# Altium schematic sheet GolgiBotV2.02_Esp.SchDoc
size A4; SheetNumber: 1; SheetTotal: 1
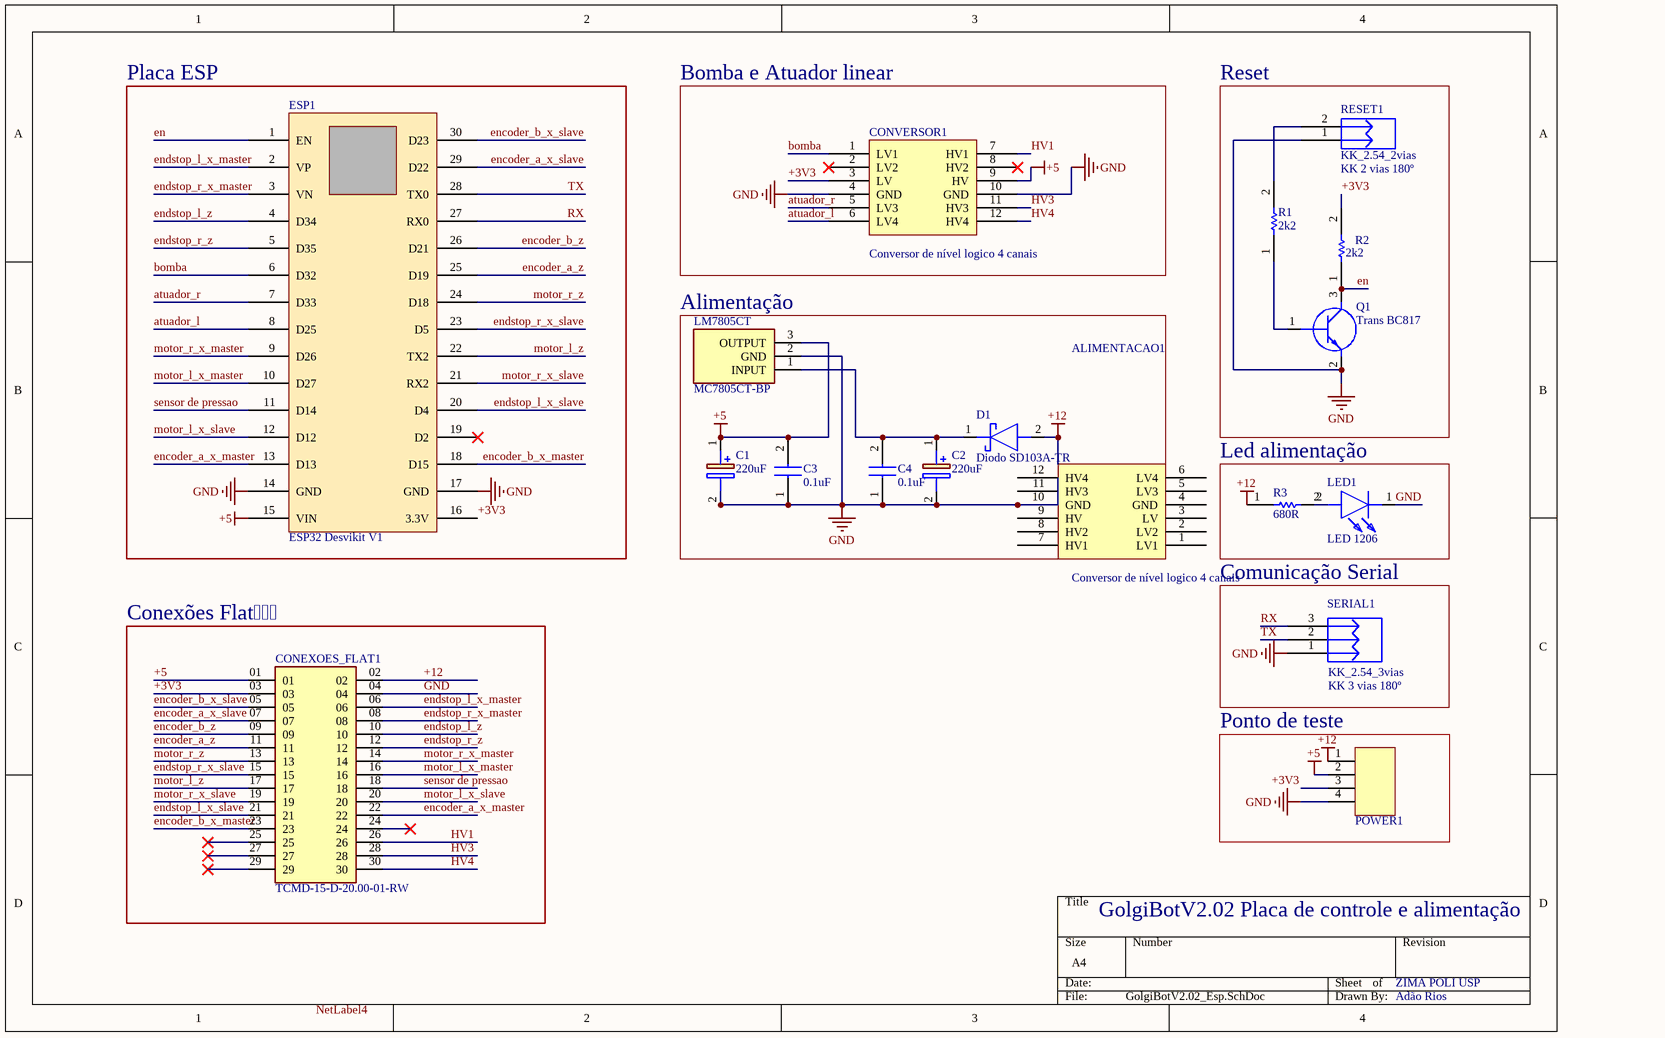
[diagram p0: GolgiBotV2.02_Esp.SchDoc]

## Parts
ALIMENTACAO1  Conversor de nível logico 4 canais  [Conversor de nível lógico 4 canais]
C1  220uF  [CAPPRD200W55D500H1200]
C2  220uF  [CAPPRD200W55D500H1200]
C3  0.1uF  [CAPC3216X180N]
C4  0.1uF  [CAPC3216X180N]
CONEXOES_FLAT1  TCMD-15-D-20.00-01-RW  [SAMTEC_TCMD-15-D-20.00-01-RW]
CONVERSOR1  Conversor de nível logico 4 canais  [Conversor de nível lógico 4 canais]
D1  Diodo SD103A-TR  [DIOAD950W60L350D150]
ESP1  value ESP32 Desvikit V1  [ESP32_Desvikit_v1]  (hidden comment: microcontrolador)
LED1  LED 1206  [LEDC3214X78N]
LM7805CT  MC7805CT-BP  [TO255P460X1020X2008-3P]
POWER1  Testing PADS 1x4  [Testing PADS 1x4]  (value not drawn)
Q1  Trans BC817  [SOT96P240X110-3N]
R1  2k2  [RESC3216X60N]
R2  2k2  [RESC3216X60N]
R3  680R  [RESC3216X60N]
RESET1  KK_2.54_2vias  Valor: KK 2 vias 180º  [KK_2VIAS_180º]
SERIAL1  KK_2.54_3vias  Valor: KK 3 vias 180º  [KK_3vias_180º]

## Blocks framed on the sheet
Placa ESP: ESP1
Bomba e Atuador linear: CONVERSOR1
Reset: Q1 R1 R2 RESET1
Alimentação: ALIMENTACAO1 C1-C4 D1 LM7805CT
Led alimentação: LED1 R3
Conexões Flat: CONEXOES_FLAT1
Comunicação Serial: SERIAL1
Ponto de teste: POWER1

## Nets
+5: C1.1(+) C3.2 CONEXOES_FLAT1.01 CONVERSOR1.9(HV) ESP1.15(VIN) LM7805CT.3(OUTPUT) POWER1.2
+12: CONEXOES_FLAT1.02 D1.2(A) POWER1.1 R3.1
GND: ALIMENTACAO1.10(GND) C1.2(-) C2.2(-) C3.1 C4.1 CONEXOES_FLAT1.04 CONVERSOR1.4(GND) CONVERSOR1.10(GND) ESP1.14(GND) ESP1.17(GND) LED1.1(K) LM7805CT.2(GND) POWER1.4 Q1.2(E) RESET1.1 SERIAL1.1
+3V3: CONEXOES_FLAT1.03 CONVERSOR1.3(LV) ESP1.16(3.3V) POWER1.3 R2.2
atuador_l: CONVERSOR1.6(LV4) ESP1.8(D25)
atuador_r: CONVERSOR1.5(LV3) ESP1.7(D33)
bomba: CONVERSOR1.1(LV1) ESP1.6(D32)
en: ESP1.1(EN) Q1.3(C) R2.1
encoder_a_x_master: CONEXOES_FLAT1.22 ESP1.13(D13)
encoder_a_x_slave: CONEXOES_FLAT1.07 ESP1.29(D22)
encoder_a_z: CONEXOES_FLAT1.11 ESP1.25(D19)
encoder_b_x_master: CONEXOES_FLAT1.23 ESP1.18(D15)
encoder_b_x_slave: CONEXOES_FLAT1.05 ESP1.30(D23)
encoder_b_z: CONEXOES_FLAT1.09 ESP1.26(D21)
endstop_l_x_master: CONEXOES_FLAT1.06 ESP1.2(VP)
endstop_l_x_slave: CONEXOES_FLAT1.21 ESP1.20(D4)
endstop_l_z: CONEXOES_FLAT1.10 ESP1.4(D34)
endstop_r_x_master: CONEXOES_FLAT1.08 ESP1.3(VN)
endstop_r_x_slave: CONEXOES_FLAT1.15 ESP1.23(D5)
endstop_r_z: CONEXOES_FLAT1.12 ESP1.5(D35)
HV1: CONEXOES_FLAT1.26 CONVERSOR1.7(HV1)
HV3: CONEXOES_FLAT1.28 CONVERSOR1.11(HV3)
HV4: CONEXOES_FLAT1.30 CONVERSOR1.12(HV4)
motor_l_x_master: CONEXOES_FLAT1.16 ESP1.10(D27)
motor_l_x_slave: CONEXOES_FLAT1.20 ESP1.12(D12)
motor_l_z: CONEXOES_FLAT1.17 ESP1.22(TX2)
motor_r_x_master: CONEXOES_FLAT1.14 ESP1.9(D26)
motor_r_x_slave: CONEXOES_FLAT1.19 ESP1.21(RX2)
motor_r_z: CONEXOES_FLAT1.13 ESP1.24(D18)
RX: ESP1.27(RX0) SERIAL1.3
sensor de pressao: CONEXOES_FLAT1.18 ESP1.11(D14)
TX: ESP1.28(TX0) SERIAL1.2
NetC2_1: C2.1(+) C4.2 D1.1(K) LM7805CT.1(INPUT)
NetLED1_2: LED1.2(A) R3.2
NetQ1_1: Q1.1(B) R1.1
NetR1_2: R1.2 RESET1.2

Not connected (* = marked no-connect by the designer): ALIMENTACAO1 1(LV1) 2(LV2) 3(LV) 4(GND) 5(LV3) 6(LV4) 7(HV1) 8(HV2) 9(HV) 11(HV3) 12(HV4); CONEXOES_FLAT1 24* 25* 27* 29*; CONVERSOR1 2(LV2)* 8(HV2)*; ESP1 19(D2)*

## Notes on the sheet
- GolgiBotV2.02 Placa de controle e alimentação
- ZIMA POLI USP
- Adão Rios
- Labels drawn without touching a wire or pin: NetLabel4

## Library data of the parts
C1 C2 = Capacitor eletrolítico D5mm: Capacitor Polarised; Manufacturer_Name: Panasonic; Manufacturer_Part_Number: ECA-0JM221; Datasheet Link: http://industrial.panasonic.com/cdbs/www-data/pdf/RDF0000/ABA0000C1218.pdf; Height: 12mm; Mouser Part Number: 667-ECA-0JM221; Mouser Price/Stock: https://www.mouser.com/Search/Refine.aspx?Keyword=667-ECA-0JM221; Arrow Part Number: ECA-0JM221; Arrow Price/Stock: https://www.arrow.com/en/products/eca-0jm221/panasonic
C3 C4 = Capacitor Cerâmico 1206: Capacitor; Manufacturer_Name: TDK; Manufacturer_Part_Number: C3216X5R0J226M160AA; Datasheet Link: https://product.tdk.com/info/en/catalog/datasheets/mlcc_commercial_midvoltage_en.pdf; Height: 1.8mm; Mouser Part Number: 810-C3216X5R0J226M-6; Mouser Price/Stock: https://www.mouser.com/Search/Refine.aspx?Keyword=810-C3216X5R0J226M-6
CONEXOES_FLAT1 = TCMD-15-D-20.00-01-RW: TCMD Series 2.00 mm IDC Ribbon Cable Assembly, Terminal; MF: Samtec; SnapEDA_Link: https://www.snapeda.com/parts/TCMD-15-D-20.00-01-RW/Samtec/view-part/?ref=snap; Package: None; Value: *; MP: TCMD-15-D-20.00-01-RW; Check_prices: https://www.snapeda.com/parts/TCMD-15-D-20.00-01-RW/Samtec/view-part/?ref=eda
D1 = Diodo SD103A-TR: Schottky Diode; Manufacturer_Name: Vishay; Datasheet Link: https://componentsearchengine.com/Datasheets/5/SD103A-TR.pdf; Manufacturer_Part_Number: SD103A-TR; Mouser Part Number: 625-SD103A; Mouser Price/Stock: https://www.mouser.co.uk/ProductDetail/Vishay-Semiconductors/SD103A-TR?qs=RwahMLkpD2urFD%2FzZdGOBw%3D%3D; Arrow Part Number: SD103A-TR; Arrow Price/Stock: https://www.arrow.com/en/products/sd103a-tr/vishay?region=nac
ESP1 = ESP32 Desvikit v1: microcontrolador com moculo bluethoth e wifi
LED1 = LED 1206: LED; Manufacturer_Name: Wurth Elektronik; Manufacturer_Part_Number: 150120BS75000; Datasheet Link: https://katalog.we-online.de/led/datasheet/150120BS75000.pdf; Height: 0.78mm; Mouser Part Number: 710-150120BS75000; Mouser Price/Stock: https://www.mouser.co.uk/ProductDetail/Wurth-Elektronik/150120BS75000?qs=LlUlMxKIyB1WGHUNBglvng%3D%3D
LM7805CT = MC7805CT-BP: Integrated Circuit; Manufacturer_Name: Micro Commercial Components (MCC); Datasheet Link: https://componentsearchengine.com/Datasheets/2/MC7805CT-BP.pdf; Height: 4.82mm; Manufacturer_Part_Number: MC7805CT-BP; Mouser Part Number: 833-MC7805CT-BP; Mouser Price/Stock: https://www.mouser.co.uk/ProductDetail/Micro-Commercial-Components-MCC/MC7805CT-BP?qs=SdqRYZZ9IxChYPR4%2FIgmYA%3D%3D; Arrow Part Number: MC7805CT-BP; Arrow Price/Stock: https://www.arrow.com/en/products/mc7805ct-bp/micro-commercial-components
POWER1 = Testing PADS 1x4: Headers & Wire Housings 40Pin 2mm Spacing Single Row Hdrs, 5pc; Manufacturer: Cromax; Mounting Angle: Vertical; Number of Positions: 40 Position; Supplier 1: -; Manufacturer Part Number: -; RoHS: RoHS Compliant; Category: Headers & Wire Housings; Stock 1: 14; Pricing 1: 1=1.60, 2=0.80 (BRL); Accessory Type: -; Contact Plating: Gold; Contact Type: -; Number of Rows: 1 Row; Product: Headers; Termination Style: Through Hole; Type: Breakaway; Brand: Cromax; Mounting Style: Straight Pin; Pitch: 2 mm; Row Spacing: -; Contact Gender: Pin (Female); Product Category: Accessories; RoHS - Mouser: Y; Minimum Order Quantity: 1; Reeling: False; ComponentLink1URL: -; ComponentLink1Description: -; Supplier Part Number 1: -
Q1 = Trans BC817: Transistor BJT NPN BC817-25-7-F; Manufacturer_Name: Diodes Inc.; Datasheet Link: https://www.diodes.com/assets/Datasheets/ds11107.pdf; Height: 1.1mm; Manufacturer_Part_Number: BC817-25-7-F; Mouser Part Number: 621-BC817-25-7-F; Mouser Price/Stock: https://www.mouser.co.uk/ProductDetail/Diodes-Incorporated/BC817-25-7-F?qs=rGAXPo9uwV0jK0EyLZnqOw%3D%3D; Arrow Part Number: BC817-25-7-F; Arrow Price/Stock: https://www.arrow.com/en/products/bc817-25-7-f/diodes-incorporated
R1-R3 = Resistor 1206: Manufacturer_Name: Vishay; Manufacturer_Part_Number: CRCW12064K70FKEA; Datasheet Link: http://docs-emea.rs-online.com/webdocs/13ec/0900766b813ecc08.pdf; Height: 0.6mm; Mouser Part Number: 71-CRCW1206-4.7K-E3; Mouser Price/Stock: https://www.mouser.co.uk/ProductDetail/Vishay-Dale/CRCW12064K70FKEA?qs=1vm4qhDHCvlKJmatsKzyFQ%3D%3D; Arrow Part Number: CRCW12064K70FKEA; Arrow Price/Stock: https://www.arrow.com/en/products/crcw12064k70fkea/vishay
RESET1 = KK_2.54_2vias: Conector KK 2.54mm 2 vias; Descrição: Conector KK 3 vias com passo 2.54mm; Encapsulamento: PTH - 180º; Modelo: 2 vias - 180º; Marca: *; Observação: *
SERIAL1 = KK_2.54_3vias: Conector KK 2.54mm 3 vias; Descrição: Conector KK 3 vias com passo 2.54mm; Encapsulamento: PTH - 180º; Modelo: 3 vias - 180º; Marca: *; Observação: *